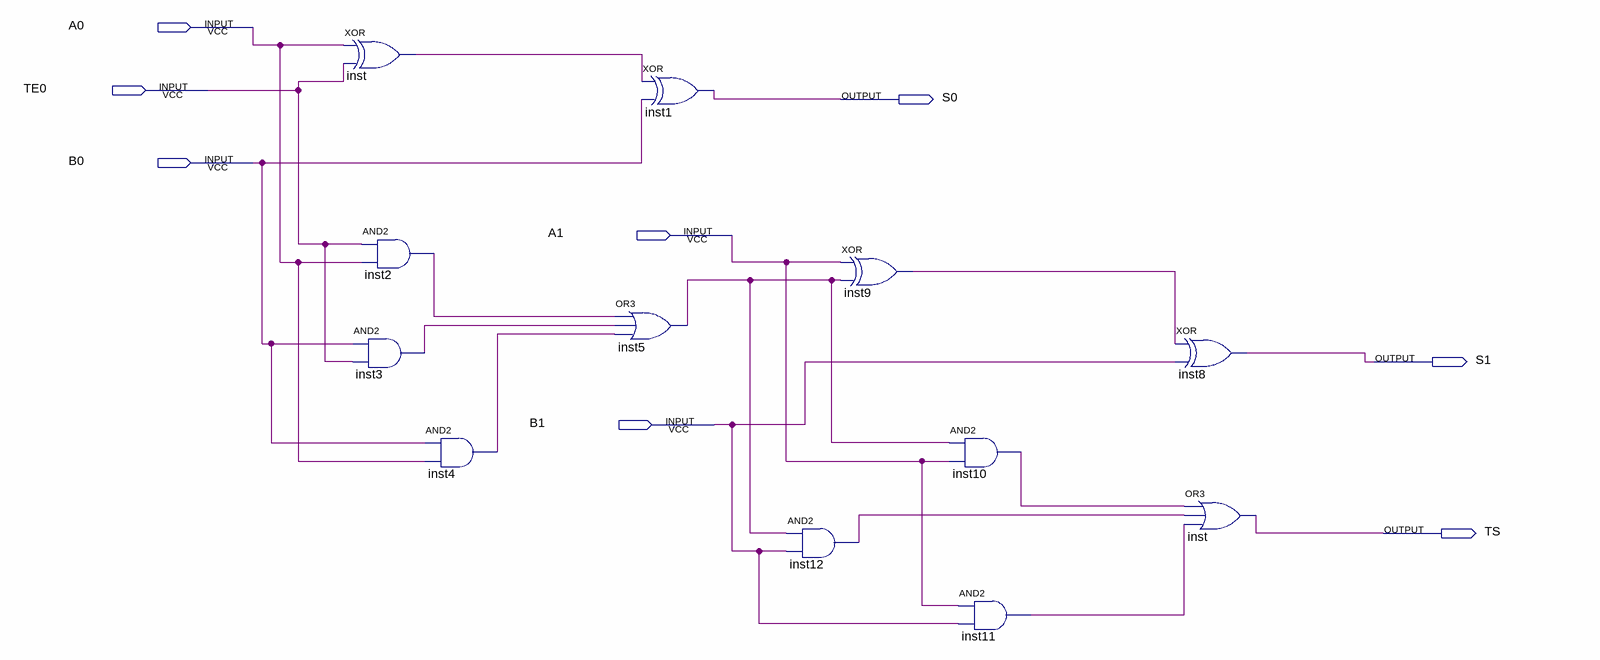
[diagram p0: schematic sheet]
// Quartus schematic teste.bdf as structural Verilog: 12 symbols, 8 pins
module teste (
  input  A0,
  input  TE0,
  input  B0,
  input  A1,
  input  B1,
  output S0,
  output S1,
  output TS
);

  wire inst2_out, inst3_out, inst4_out, inst5_out, inst9_out, inst10_out, inst11_out, inst12_out, inst_out;

  xor inst (inst_out, A0, TE0);
  and inst2 (inst2_out, TE0, A0);
  and inst3 (inst3_out, B0, TE0);
  and inst4 (inst4_out, B0, A0);
  xor inst1 (S0, inst_out, B0);
  or inst5 (inst5_out, inst2_out, inst3_out, inst4_out);
  and inst12 (inst12_out, inst5_out, B1);
  xor inst9 (inst9_out, A1, inst5_out);
  and inst10 (inst10_out, inst5_out, A1);
  and inst11 (inst11_out, A1, B1);
  xor inst8 (S1, inst9_out, B1);
  or inst_dup2 (TS, inst10_out, inst12_out, inst11_out);
endmodule
